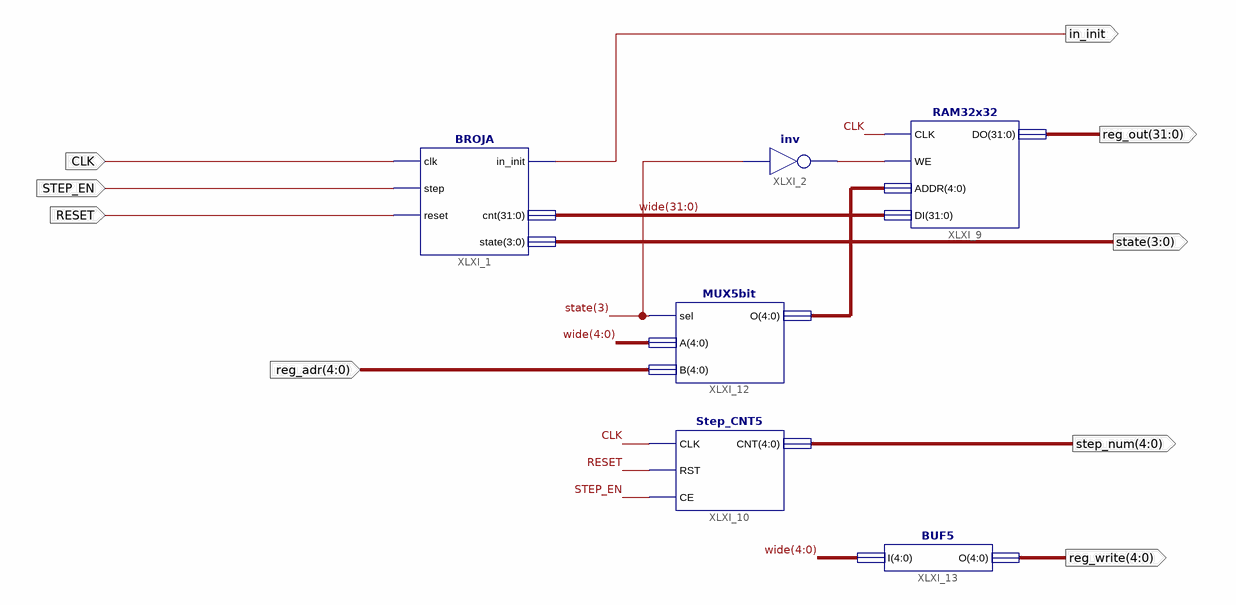
[diagram p0: schematic sheet 1]
// Xilinx ISE schematic master_ver.sch (spartan6) as structural Verilog: 6 symbols, 9 ports
module master_ver (
  input  CLK,
  input  STEP_EN,
  input  RESET,
  input  [4:0] reg_adr,
  output [31:0] reg_out,
  output [4:0] step_num,
  output [3:0] state,
  output [4:0] reg_write,
  output in_init
);

  wire XLXN_9;
  wire [4:0] Data;
  wire [31:0] wide;

  not XLXI_2 (XLXN_9, state[3]);
  BROJA XLXI_1 (.clk(CLK), .step(STEP_EN), .reset(RESET), .in_init(in_init), .cnt(wide), .state(state));
  RAM32x32 XLXI_9 (.CLK(CLK), .WE(XLXN_9), .ADDR(Data), .DI(wide), .DO(reg_out));
  MUX5bit XLXI_12 (.sel(state[3]), .A(wide[4:0]), .B(reg_adr), .O(Data));
  BUF5 XLXI_13 (.I(wide[4:0]), .O(reg_write));
  Step_CNT5 XLXI_10 (.CLK(CLK), .RST(RESET), .CE(STEP_EN), .CNT(step_num));
endmodule
